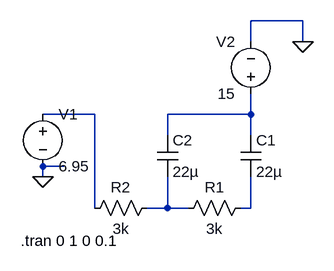
[diagram p0: schematic Draft1.asc]
Draft1.asc, the LTspice schematic file:
Version 4
SHEET 1 880 680
WIRE 368 -32 288 -32
WIRE 288 0 288 -32
WIRE 368 0 368 -32
WIRE 48 112 -32 112
WIRE 288 112 288 80
WIRE 288 112 160 112
WIRE 160 144 160 112
WIRE 288 144 288 112
WIRE 0 192 -32 192
WIRE -32 208 -32 192
WIRE 48 256 48 112
WIRE 160 256 160 208
WIRE 160 256 128 256
WIRE 192 256 160 256
WIRE 288 256 288 208
WIRE 288 256 272 256
FLAG -32 208 0
FLAG 368 0 0
SYMBOL voltage -32 96 R0
WINDOW 123 0 0 Left 0
WINDOW 39 0 0 Left 0
SYMATTR InstName V1
SYMATTR Value 6.95
SYMBOL cap 272 144 R0
SYMATTR InstName C1
SYMATTR Value 22µ
SYMBOL cap 144 144 R0
SYMATTR InstName C2
SYMATTR Value 22µ
SYMBOL res 288 240 R90
WINDOW 0 0 56 VBottom 2
WINDOW 3 32 56 VTop 2
SYMATTR InstName R1
SYMATTR Value 3k
SYMBOL res 144 240 R90
WINDOW 0 0 56 VBottom 2
WINDOW 3 32 56 VTop 2
SYMATTR InstName R2
SYMATTR Value 3k
SYMBOL voltage 288 96 R180
WINDOW 0 24 96 Left 2
WINDOW 3 24 16 Left 2
WINDOW 123 0 0 Left 0
WINDOW 39 0 0 Left 0
SYMATTR InstName V2
SYMATTR Value 15
TEXT -66 306 Left 2 !.tran 0 1 0 0.1

The netlist it stands for:
* Draft1.asc
V1 N001 0 6.95
C1 N002 N004 22µ
C2 N002 N003 22µ
R1 N004 N003 3k
R2 N003 N001 3k
V2 N002 0 15
.tran 0 1 0 0.1
.backanno
.end